# Altium project PCB_Robo_Hand.PrjPcb
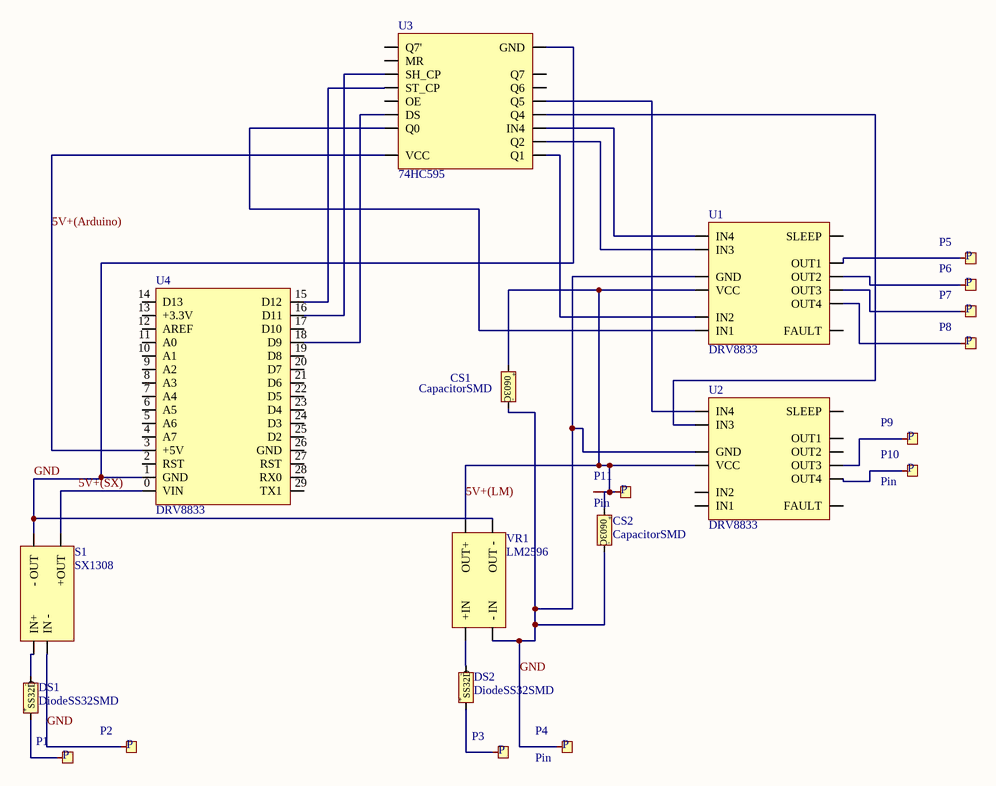
[diagram p0: Sheet_Robo_Hand_main.SchDoc]
1 sheet, 21 parts. Net scope: global (net labels, ports and power ports of the same name join across sheets).
Board files: PCBH.PcbDoc, Definitive_Robo_Hand_main.PcbDoc, PCB1.PcbDoc

## Sheet Sheet_Robo_Hand_main.SchDoc
size A4; SheetNumber: 1; SheetTotal: 1

### Parts
CS1  CapacitorSMD  [CapacitorSMD]
CS2  CapacitorSMD  [CapacitorSMD]
DS1  DiodeSS32SMD  [DiodeSS32SMD]
DS2  DiodeSS32SMD  [DiodeSS32SMD]
P1  Pin  [P]  (value not drawn)
P2  Pin  [P]  (value not drawn)
P3  Pin  [P]  (value not drawn)
P4  Pin  [P]
P5  Pin  [P]  (value not drawn)
P6  Pin  [P]  (value not drawn)
P7  Pin  [P]  (value not drawn)
P8  Pin  [P]  (value not drawn)
P9  Pin  [P]  (value not drawn)
P10  Pin  [P]
P11  Pin  [P]
S1  SX1308  [DC-DC Step-Up Footprint]
U1  DRV8833  [PCB_DRV8833]  (no BOM)
U2  DRV8833  [PCB_DRV8833]  (no BOM)
U3  74HC595  [PCB_74HC595_Footprint]
U4  DRV8833  [PCB_ATMega328p]  (no BOM)
VR1  LM2596  [DC-DC Step-Down Footprint]

### Nets
5V+(Arduino): U3.8(VCC) U4.3(+5V)
5V+(LM): CS1.0(+) CS2.0(+) P11.0 U1.2(VCC) U2.2(VCC) VR1.2(OUT+)
5V+(SX): S1.0(+OUT) U4.0(VIN)
GND: CS1.1(-) CS2.1(-) P2.0 P4.0 S1.1(-_OUT) S1.2(IN_-) U1.3(GND) U2.3(GND) U3.0(GND) U4.1(GND) VR1.1(-_IN) VR1.3(OUT_-)
NetDS1_0: DS1.0(+) P1.0
NetDS1_1: DS1.1(-) S1.3(IN+)
NetDS2_0: DS2.0(+) P3.0
NetDS2_1: DS2.1(-) VR1.0(+IN)
NetP5_0: P5.0 U1.7(OUT1)
NetP6_0: P6.0 U1.8(OUT2)
NetP7_0: P7.0 U1.9(OUT3)
NetP8_0: P8.0 U1.10(OUT4)
NetP9_0: P9.0 U2.9(OUT3)
NetP10_0: P10.0 U2.10(OUT4)
NetU1_0: U1.0(IN1) U3.9(Q0)
NetU1_1: U1.1(IN2) U3.7(Q1)
NetU1_4: U1.4(IN3) U3.6(Q2)
NetU1_5: U1.5(IN4) U3.5(IN4)
NetU2_4: U2.4(IN3) U3.4(Q4)
NetU2_5: U2.5(IN4) U3.3(Q5)
NetU3_10: U3.10(DS) U4.18(D9)
NetU3_12: U3.12(ST_CP) U4.15(D12)
NetU3_13: U3.13(SH_CP) U4.16(D11)

Not connected (* = marked no-connect by the designer): U1 6(SLEEP) 11(FAULT); U2 0(IN1) 1(IN2) 6(SLEEP) 7(OUT1) 8(OUT2) 11(FAULT); U3 1(Q7) 2(Q6) 11(OE) 14(MR) 15(Q7'); U4 2(RST) 4(A7) 5(A6) 6(A5) 7(A4) 8(A3) 9(A2) 10(A1) 11(A0) 12(AREF) 13(+3.3V) 14(D13) 17(D10) 19(D8) 20(D7) 21(D6) 22(D5) 23(D4) 24(D3) 25(D2) 26(GND) 27(RST) 28(RX0) 29(TX1)

### Notes on the sheet
- (in symbol CapacitorSMD) 0603C
- (in symbol DiodeSS32SMD) SS32D
- (in symbol Pin) P

### Library data of the parts
S1 = SX1308: Модуль mini DC-DC Step-Up Converter 2.5...10V to 5V / 8V / 9V / 12V - это миниатюрный повышающий преобразователь постоянного тока на микросхеме импульсного преобразователя SX1308. / Выходное напряжение на преобразователе имеет четыре фиксированных настройки - 5В, 8В, 9В или 12В, одно из этих напряжений выбирается запайкой соответствующей комбинации перемычек A и B (по табличке на обратной стороне платы). / Максимальный выходной ток зависит от установленного выходного напряжения, при 5В он равен 1А, при 8В - 0.5А, 9В - 0,45А, 12В - 0.3А. Частота преобразования - 1.2 МГц. / На плате (со стороны Vout) светодиод - индикатор питания. По умолчанию он выключен. Для включения этого светодиода также нужно запаять соседнюю перемычку.
U1 U2 = Motor Driver: Драйвер крокового/колекторних двигунів DRV8833
U3 = SCS-16: SN74HC595N - вихідний зсувний регістр 74HC595
U4 = Arduino Nano: DCCduino Nano CH340 - аналог Arduino Nano v3.0 TYPE C
VR1 = DC-DC Step-Down: DC-DC конвертер знижуючий 4.5...40В на 1.5...35В на LM2596